# EasyEDA Pro project SRH_V2.0.eprj

# Schematic Schematic1
Create Date: 2023-11-20; Page Name: P1; Project Name: SRH_V2.0; Schematic Name: Schematic1; Update Date: 2025-01-16; Company: 嘉立创EDA; Page Size: A4; Version: V1.0
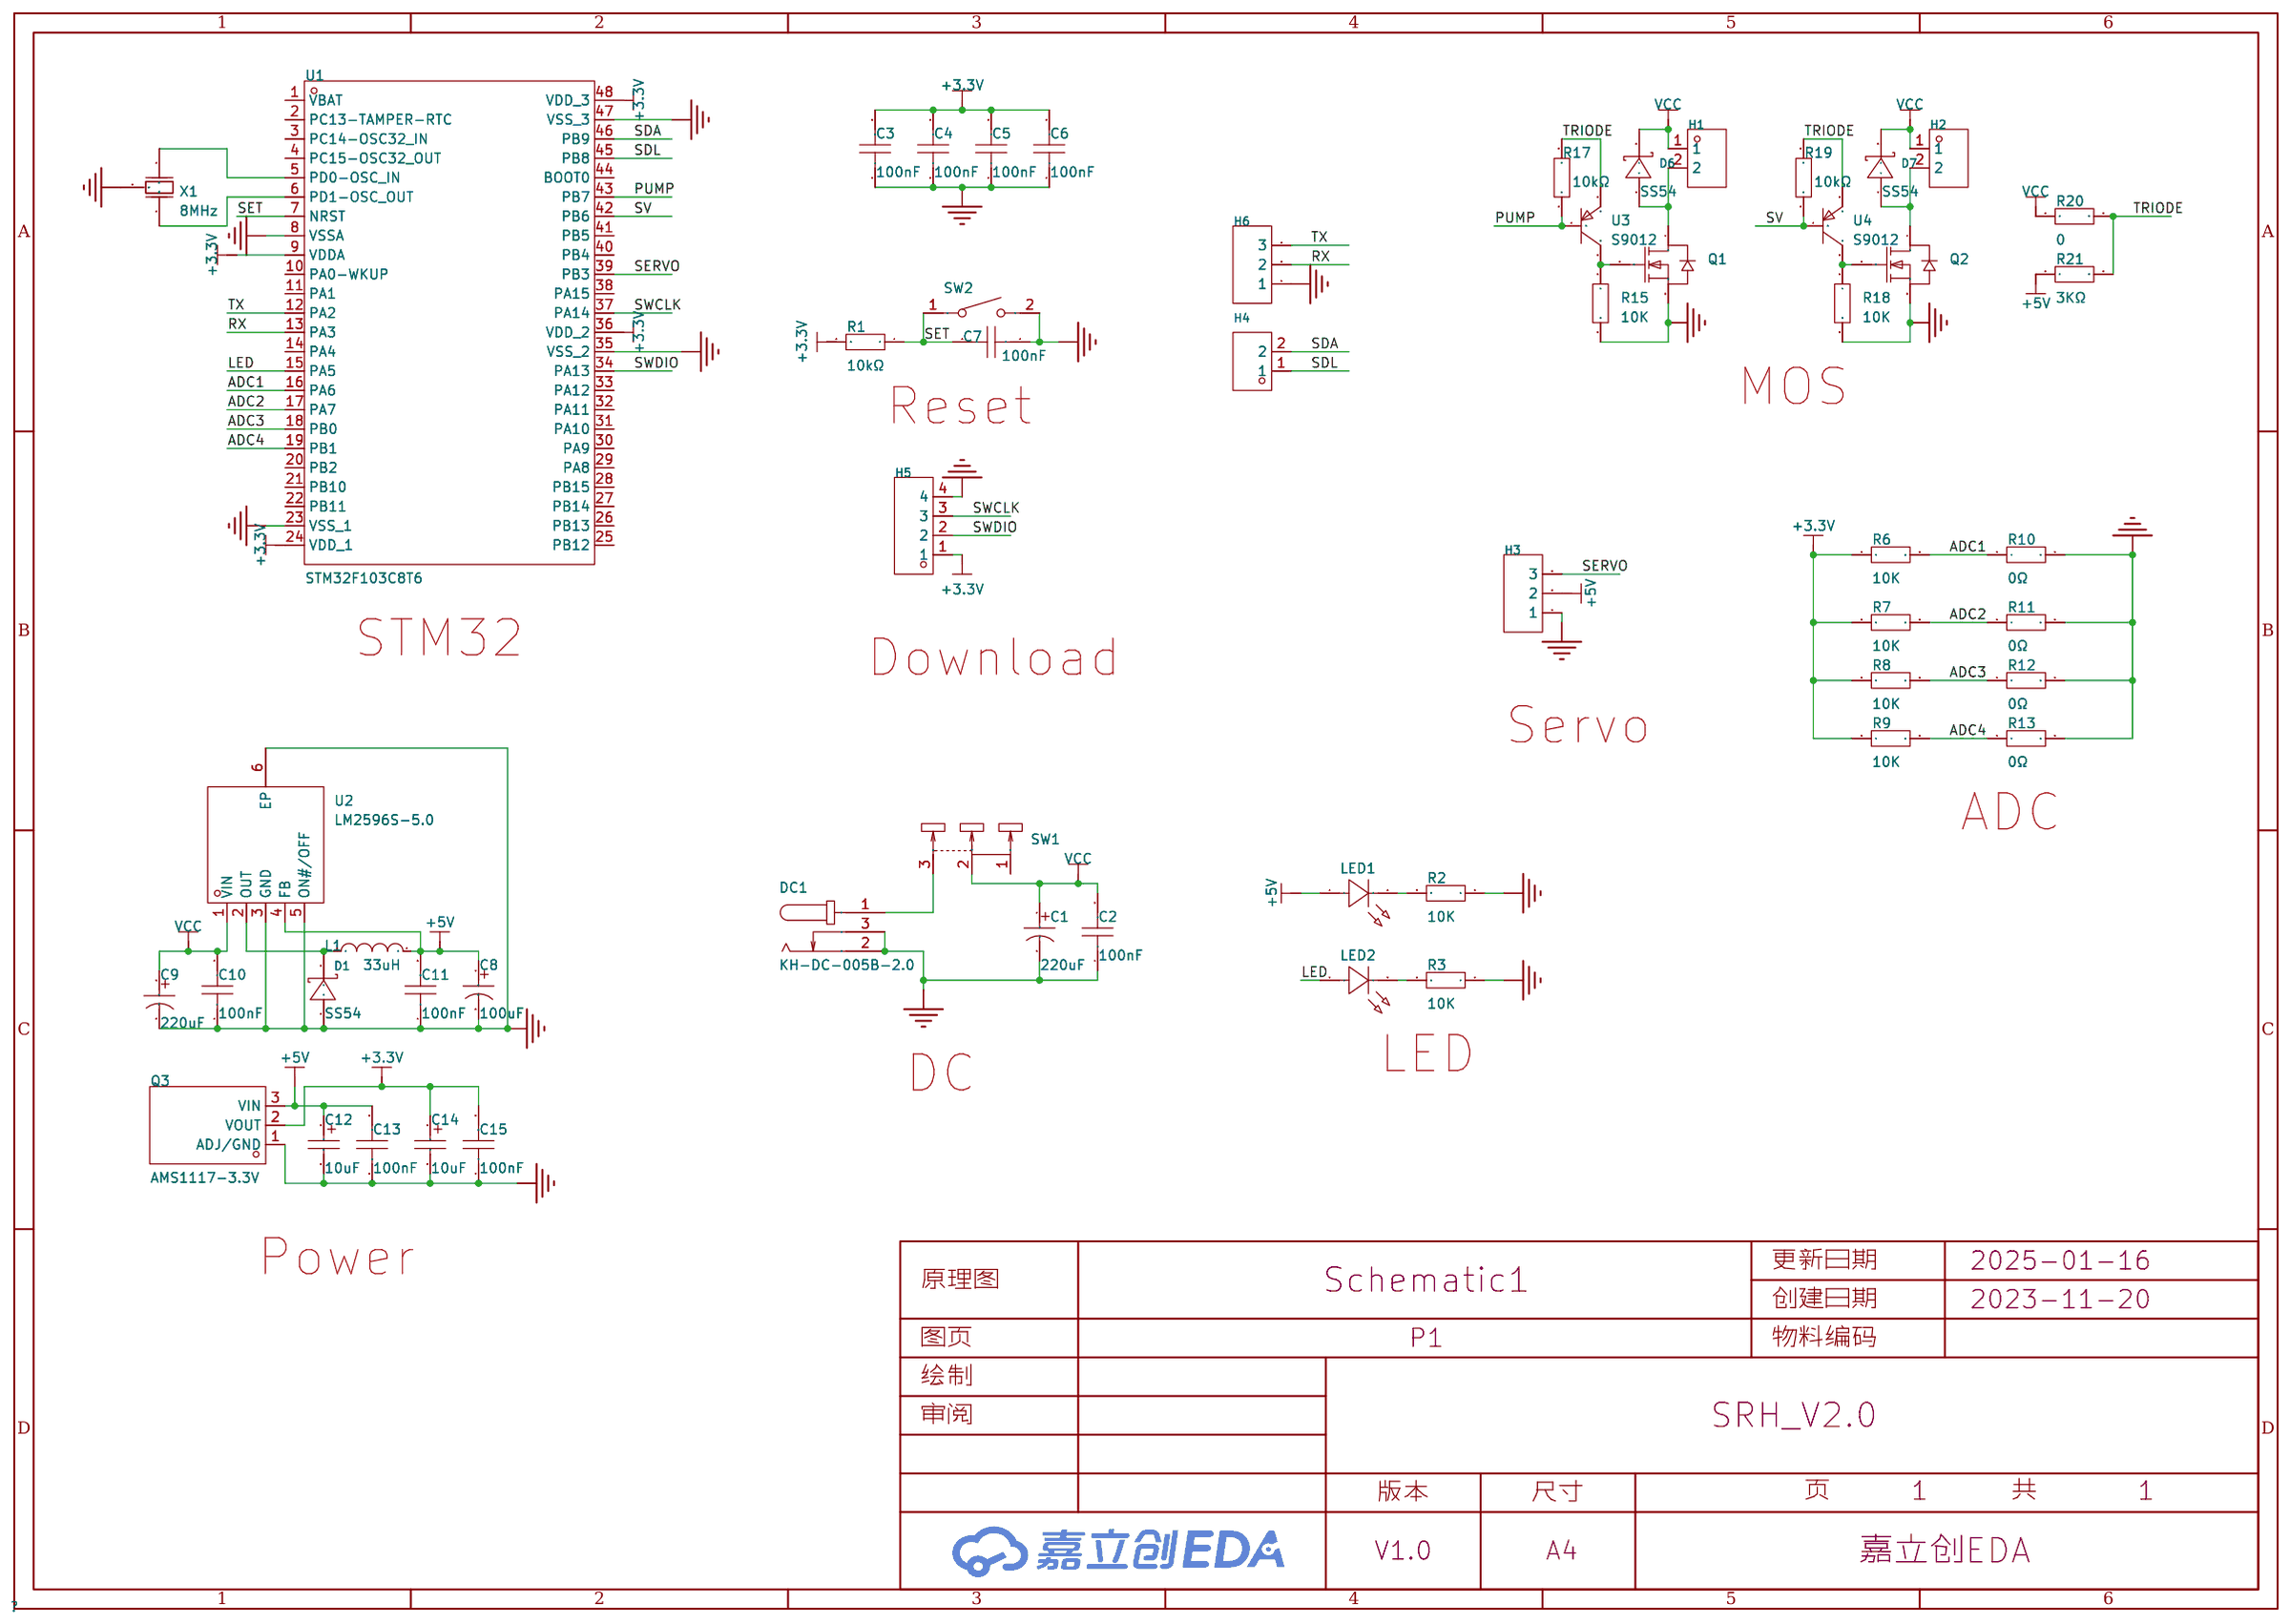
[diagram p0: schematic sheet]

## Parts
C1  220uF  [CAP-TH_BD6.3-P2.50-D1.0-FD]
C2  100nF  [C0603]
C3  100nF  [C0603]
C4  100nF  [C0603]
C5  100nF  [C0603]
C6  100nF  [C0603]
C7  100nF  [C0603]
C8  100uF  [CAP-TH_BD5.0-P2.00-D0.8-FD]
C9  220uF  [CAP-TH_BD6.3-P2.50-D1.0-FD]
C10  100nF  [C0603]
C11  100nF  [C0603]
C12  10uF  [CASE-A_3216]
C13  100nF  [C0603]
C14  10uF  [CASE-A_3216]
C15  100nF  [C0603]
D1  SS54  [SMA_L4.4-W2.8-LS5.4-R-RD]
D6  SS54  [SMA_L4.4-W2.8-LS5.4-R-RD]
D7  SS54  [SMA_L4.4-W2.8-LS5.4-R-RD]
DC1  KH-DC-005B-2.0  [DC-IN-TH_KH-DC-005B-2.0]
H1  PZ254V-11-02P  [HDR-TH_2P-P2.54-V-M]
H2  PZ254V-11-02P  [HDR-TH_2P-P2.54-V-M]
H3  2.54-1*3P针  [HDR-TH_3P-P2.54-V-M-1]
H4  PZ254V-11-02P  [HDR-TH_2P-P2.54-V-M]
H5  PZ254V-11-04P  [HDR-TH_4P-P2.54-V-M]
H6  2.54-1*3P针  [HDR-TH_3P-P2.54-V-M-1]
L1  33uH  [IND-SMD_L7.5-W7.5_CYH74]
LED1  19-213/GHC-ZN2Q1B8X/3T  [LED-SMD_L1.6-W0.8-RD-2]
LED2  19-213/GHC-ZN2Q1B8X/3T  [LED-SMD_L1.6-W0.8-RD-2]
Q1  IRLR7843TRPBF  [TO-252-2_L6.5-W6.1-P4.58-LS10.0-TR]
Q2  IRLR7843TRPBF  [TO-252-2_L6.5-W6.1-P4.58-LS10.0-TR]
Q3  AMS1117-3.3V  [SOT-89-3_L4.5-W2.5-P1.50-LS4.2-BR]
R1  10kΩ  [R0603]
R2  10K  [R0603]
R3  10K  [R0603]
R6  10K  [R0603]
R7  10K  [R0603]
R8  10K  [R0603]
R9  10K  [R0603]
R10  0Ω  [R1206]
R11  0Ω  [R1206]
R12  0Ω  [R1206]
R13  0Ω  [R1206]
R15  10K  [R0603]
R17  10kΩ  [R0603]
R18  10K  [R0603]
R19  10kΩ  [R0603]
R20  0  [R0603]
R21  3KΩ  [R0603]
SW1  SS-12D10L3  [SW-TH_SS-12D10L3]
SW2  TS-1185EC-C-D-B  [SW-SMD_4P-L3.7-W3.0-P1.50-LS4.7]
U1  STM32F103C8T6  [LQFP-48_L7.0-W7.0-P0.50-LS9.0-BL]
U2  LM2596S-5.0  [TO-263-5_L10.2-W8.9-P1.70-BR]
U3  S9012  [SOT-23-3_L2.9-W1.4-P1.90-LS2.6-BR]
U4  S9012  [SOT-23-3_L2.9-W1.4-P1.90-LS2.6-BR]
X1  8MHz  [OSC-SMD_3P-L3.2-W1.3-P1.2-L]

## Library data of the parts
C1 C9 = KS227M016E07RR0VH2FP0: 容值:220uF;精度:±20%;额定电压:16V;纹波电流:-;等效串联电阻:-;; LCSC Part Name: 220uF ±20% 16V; Supplier Part: C43340; Manufacturer: CX(承兴); Supplier Footprint: 插件,D6.3xL7mm; JLCPCB Part Class: 扩展库; Datasheet: https://atta.szlcsc.com/upload/public/pdf/source/20211027/7B10195EF01EB9374BE8935690E3D906.pdf; Supplier: LCSC; Tolerance: ±20%; Rated Voltage: 16V; φD: 6.3mm; L: 7mm; Lead Spacing: 2.5mm; Lifetime @ Temp: 1000hrs@105℃
C2 C13 C15 = CAP_0603: Supplier Footprint: 0603
C3-C7 C10 C11 = CC0603KRX7R9BB104: 容值:100nF;精度:±10%;额定电压:50V;材质(温度系数):X7R;; LCSC Part Name: 100nF ±10% 50V; Supplier Part: C14663; Manufacturer: YAGEO(国巨); Supplier Footprint: 0603; JLCPCB Part Class: Basic Part; Datasheet: https://atta.szlcsc.com/upload/public/pdf/source/20180910/C282072_33301C7F631E79921B82A8DAC6BCC5B3.pdf; Supplier: LCSC; Tolerance: ±10%; Voltage Rated: 50V; Temperature Coefficient: X7R
C8 = KS107M010D07RR0VH2FP0: 容值:100uF;精度:±20%;额定电压:10V;纹波电流:50mA@120Hz;等效串联电阻:-;; LCSC Part Name: 100uF ±20% 10V; Supplier Part: C43315; Manufacturer: CX(承兴); Supplier Footprint: 插件,D5xL7mm; JLCPCB Part Class: 扩展库; Datasheet: https://atta.szlcsc.com/upload/public/pdf/source/20211027/7B10195EF01EB9374BE8935690E3D906.pdf; Supplier: LCSC; Tolerance: ±20%; Rated Voltage: 10V; φD: 5mm; L: 7mm; Lead Spacing: 2mm; Ripple Current: 50mA@120Hz; Lifetime @ Temp: 1000hrs@105℃
C12 C14 = CA45A-A-16V-10uF-K: 容值:10uF;精度:±10%;额定电压:16V;等效串联电阻:7Ω@100kHz;; LCSC Part Name: 10uF ±10% 16V; Supplier Part: C129279; Manufacturer: CEC(振华新云); Supplier Footprint: CASE-A-3216; JLCPCB Part Class: 扩展库; Datasheet: https://atta.szlcsc.com/upload/public/pdf/source/20170914/C129279_1505359932790968137.pdf; Supplier: LCSC; Tolerance: ±10%; Rated Voltage: 16V; Equivalent Series Resistance(ESR): 7Ω@100kHz; Operating Temperature: -55℃~+125℃
D1 D6 D7 = SS54_C22452: 直流反向耐压（Vr）:40V;平均整流电流（Io）:5A;正向压降（Vf）:550mV @ 5A;; Supplier Part: C22452; Manufacturer: MDD; Supplier Footprint: SMA(DO-214AC); JLCPCB Part Class: 基础库; Supplier: LCSC
DC1 = KH-DC-005B-2.0: 连接器类型:DC电源插座;安装方式:弯插;触点内径:2mm;触点外径:6.3mm;额定电流:500mA;额定电压:30V;工作温度范围:-30℃~+70℃;; LCSC Part Name: DC电源插座 内径:2mm 外径:6.3mm; Supplier Part: C2847171; Manufacturer: kinghelm(金航标); Supplier Footprint: 插件; JLCPCB Part Class: Extended Part; Datasheet: https://atta.szlcsc.com/upload/public/pdf/source/20230214/A6338618A3D8E8EB8F2C466F0AFC1E00.pdf; Supplier: LCSC; Connector Type: DC电源插座; Mounting Style: 弯插; Inside Contact Diameter: 2mm; Outside Contact Diameter: 6.3mm; Current Rating (Max): 500mA; Voltage Rating (Max): 30V; Operating Temperature Range: -30℃~+70℃
H1 H2 H4 = PZ254V-11-02P: 排数:单排;总PIN位数:2P;间距:2.54mm;插针结构:1x2P;行距:-;安装类型:直插;圆针/方针:方针;额定电流:-;额定电压:-;配合针长度:6mm;塑高:2.5mm;端接针长度:3mm;触头材质:黄铜;触头镀层:-;工作温度范围:-40℃~+105℃;颜色:黑色;; LCSC Part Name: 2.54mm 1x2P 直插 方针; Supplier Part: C492401; Manufacturer: XFCN(兴飞); Supplier Footprint: 插件,P=2.54mm; JLCPCB Part Class: 扩展库; Datasheet: https://atta.szlcsc.com/upload/public/pdf/source/20200309/C492401_A812433581A9B211A7FFA413ADDFF0E5.pdf; Supplier: LCSC; Number of Rows: 单排; Number of Pins: 2P; Pitch: 2.54mm; Pin Structure: 1x2P; Mounting Type: 直插; Circluar Pins/Square Pins: 方针; Length of Mating Pin: 6mm; Insulation Height: 2.5mm; Length of End Connection Pin: 3mm; Contact Material: 黄铜; Operating Temperature Range: -40℃~+105℃; Color: 黑色
H3 H6 = 2.54-1*3P针: 排数:单排;总PIN位数:3;间距:2.54mm;插针结构:1x3P;行距:-;安装类型:直插;圆针/方针:方针;额定电流:3A;额定电压:-;配合针长度:-;塑高:-;端接针长度:-;触头材质:-;触头镀层:-;工作温度范围:-40℃~+105℃;颜色:黑色;; LCSC Part Name: 2.54mm 1x3P 直插 方针; Supplier Part: C49257; Manufacturer: BOOMELE(博穆精密); Supplier Footprint: 直插,P=2.54mm; JLCPCB Part Class: 扩展库; Supplier: LCSC; Number of Rows: 单排; Number of Pins: 3; Pitch: 2.54mm; Pin Structure: 1x3P; Mounting Type: 直插; Circluar Pins/Square Pins: 方针; Current Rating (Max): 3A; Operating Temperature Range: -40℃~+105℃; Color: 黑色
H5 = PZ254V-11-04P: 排数:单排;总PIN位数:4P;间距:2.54mm;插针结构:1x4P;行距:-;安装类型:直插;圆针/方针:方针;额定电流:3A;额定电压:250V;配合针长度:6mm;塑高:2.5mm;端接针长度:3mm;触头材质:-;工作温度范围:-40℃~+105℃;颜色:黑色;; LCSC Part Name: 2.54mm 1x4P 直插 方针; Supplier Part: C2691448; Manufacturer: XFCN(兴飞); Supplier Footprint: 插件,P=2.54mm; JLCPCB Part Class: 扩展库; Datasheet: https://atta.szlcsc.com/upload/public/pdf/source/20200309/C492403_F9F19131791D08044AD4F84F8E751A34.pdf; Supplier: LCSC; Number of Rows: 单排; Number of Pins: 4P; Pitch: 2.54mm; Pin Structure: 1x4P; Mounting Type: 直插; Circluar Pins/Square Pins: 方针; Current Rating (Max): 3A; Voltage Rating (Max): 250V; Length of Mating Pin: 6mm; Insulation Height: 2.5mm; Length of End Connection Pin: 3mm; Operating Temperature Range: -40℃~+105℃; Color: 黑色
L1 = CYH74-33UH: 类型:-;电感值:33uH;精度:±20%;额定电流:-;饱和电流(Isat):-;; LCSC Part Name: 33uH ±20%; Supplier Part: C2879696; Manufacturer: SHOU HAN(首韩); Supplier Footprint: SMD,7.5x7.5mm; JLCPCB Part Class: 扩展库; Datasheet: https://atta.szlcsc.com/upload/public/pdf/source/20210813/91E1001E07795DE2AA14A81FBCD1BD6C.pdf; Supplier: LCSC; Tolerance: ±20%
LED1 LED2 = 19-213/GHC-ZN2Q1B8X/3T: LCSC Part Name: LED; Supplier Part: C4749155; Manufacturer: EVERLIGHT(亿光); Supplier Footprint: SMD,0.8x1.6mm; JLCPCB Part Class: Extended Part; Datasheet: https://atta.szlcsc.com/upload/public/pdf/source/20220713/A02AED81541ACC0AB94B59F8C2FBBAFC.pdf; Supplier: LCSC
Q1 Q2 = IRLR7843TRPBF: 类型:N沟道;漏源电压(Vdss):30V;连续漏极电流(Id):161A;功率(Pd):140W;导通电阻(RDS(on)@Vgs,Id):3.3mΩ@10V,15A;阈值电压(Vgs(th)@Id):2.3V@250μA;; LCSC Part Name: N沟道 30V 161A; Supplier Part: C21988; Manufacturer: Infineon(英飞凌); Supplier Footprint: TO-252-2(DPAK); JLCPCB Part Class: Extended Part; Datasheet: https://atta.szlcsc.com/upload/public/pdf/source/20140314/1457707013919.pdf; Supplier: LCSC; Type: N沟道; Drain Source Voltage (Vdss): 30V; Continuous Drain Current (Id): 161A; Power Dissipation (Pd): 140W; Drain Source On Resistance (RDS(on)@Vgs,Id): 3.3mΩ@10V,15A; Gate Threshold Voltage (Vgs(th)@Id): 2.3V@250μA
Q3 = AMS1117-3.3V_C5120796: 输出类型:固定;输出极性:正;最大输入电压:18V;输出电压:3.3V;输出电流:1A;; LCSC Part Name: 输入18V 输出3.3V 1A; Supplier Part: C5120796; Manufacturer: MSKSEMI(美森科); Supplier Footprint: SOT-89; JLCPCB Part Class: 扩展库; Datasheet: https://atta.szlcsc.com/upload/public/pdf/source/20230802/A3918E880B22D5DA08FB6633703CD81C.pdf; Supplier: LCSC; Output Type: 固定; Output Polarity: 正; Number of Outputs: 1; Maximum Input Voltage: 18V; Output Voltage: 3.3V; Dropout Voltage: 1.4V@(1A); Quiescent Current (Ground Current): 12mA; Output Current: 1A; Operating Temperature: 0℃~+125℃
R1 R17 R19 = 0603WAF1002T5E: 电阻类型:厚膜电阻;阻值:10kΩ;精度:±1%;功率:100mW;; LCSC Part Name: 厚膜电阻 10kΩ ±1% 100mW; Supplier Part: C25804; Manufacturer: UNI-ROYAL(厚声); Supplier Footprint: 0603; JLCPCB Part Class: Basic Part; Datasheet: https://atta.szlcsc.com/upload/public/pdf/source/20200306/C422600_1E6D84923E4A46A82E41ADD87F860B5C.pdf; Supplier: LCSC; Type: 厚膜电阻; Tolerance: ±1%; Power(Watts): 100mW; Temperature Coefficient: ±100ppm/℃; Overload Voltage (Max): 75V; Operating Temperature Range: -55℃~+155℃
R2 R3 R6-R9 R15 R18 R20 R21 = Res_0603: Supplier Footprint: 0603
R10-R13 = 1206W4F0000T5E: 电阻类型:厚膜电阻;阻值:0Ω;精度:±1%;功率:250mW;温度系数:±800ppm/℃;最大工作电压:200V;工作温度范围:-55℃~+155℃;; LCSC Part Name: 0Ω ±1% 250mW; Supplier Part: C17888; Manufacturer: UNI-ROYAL(厚声); Supplier Footprint: 1206; JLCPCB Part Class: Basic Part; Supplier: LCSC; Type: 厚膜电阻; Tolerance: ±1%; Power(Watts): 250mW; Temperature Coefficient: ±800ppm/℃; Overload Voltage (Max): 200V; Operating Temperature Range: -55℃~+155℃
SW1 = SS-12D10L3: 额定电流(DC):3A;额定电压(DC):125V;额定电流(AC):3A;额定电压(AC):125V;电路结构:单刀双掷;安装方式:直插;机械寿命:1万次;开关颜色:黑色;; LCSC Part Name: 柄长3mm 直插双档 滑动开关 大电流; Supplier Part: C319013; Manufacturer: XKB Connectivity(中国星坤); Supplier Footprint: 插件; JLCPCB Part Class: Extended Part; Datasheet: https://atta.szlcsc.com/upload/public/pdf/source/20211009/D6412F37AABE6F9459A6EE7FA4DAEADB.pdf; Supplier: LCSC; Current Rating (DC): 3A; Voltage Rating (DC): 125V; Current Rating (AC): 3A; Voltage Rating (AC): 125V; Circuit: 单刀双掷; Mounting Style: 直插; Mechanical Life: 1万次; Actuator Color: 黑色; Actuator Style: 矩形柱状; Pin Style: PC引脚; Operating Temperature: -40℃~+85℃; Switch Length: 13mm; Switch Width: 6.8mm; Switch Height: 6.4mm
SW2 = TS-1185EC-C-D-B: 触点电流:50mA;额定电压(DC):12V;绝缘电阻:-;电路结构:单刀单掷;安装方式:立贴;带灯:无;作用力:260gf;机械寿命:10万次;带支架:否;; LCSC Part Name: 3.65*3*2mm 立贴 轻触开关; Supplier Part: C318893; Manufacturer: XKB Connectivity(中国星坤); Supplier Footprint: SMD; JLCPCB Part Class: 扩展库; Datasheet: https://atta.szlcsc.com/upload/public/pdf/source/20211011/37251E5FC3BB5C155D4391B78D14163F.pdf; Supplier: LCSC; Contact Current: 50mA; Voltage Rating (DC): 12V; Circuit: 单刀单掷; Mounting Style: 立贴; Actuator Style: 圆形按钮; Actuator/Cap Color: 黑色; With Lamp: 无; Operating Force: 260gf; Mechanical Life: 10万次; Operating Temperature: -30℃~+85℃; Switch Length: 3.65mm; Switch Width: 3mm; Switch Height: 2mm; Strike Gundam: 否
U1 = STM32F103C8T6: CPU内核:ARM Cortex-M3;CPU最大主频:72MHz;工作电压范围:2V~3.6V;程序存储容量:64KB;程序存储器类型:FLASH;RAM总容量:20KB;GPIO端口数量:37;; LCSC Part Name: STM32F103C8T6 MSL=3; Supplier Part: C8734; Manufacturer: ST(意法半导体); Supplier Footprint: LQFP-48(7x7); JLCPCB Part Class: 扩展库; Datasheet: https://atta.szlcsc.com/upload/public/pdf/source/20220812/8363ACEC51AD55ECEB84799464F7CB85.pdf; Supplier: LCSC; CPU Core: ARM Cortex-M3; CPU Maximum Speed: 72MHz; Operating Voltage Range: 2V~3.6V; Program Storage Size: 64KB; Program Memory Type: FLASH; RAM Size: 20KB; GPIO Ports Number: 37; ADC (Bit): 12bit; Universal Serial Bus: 有; Peripheral/Function: 看门狗；DMA；看门狗；片载温度传感器; Watchdog: 有; Infrared Data Association: 有; Low-Voltage Detect: 有; Direct Memory Access: 有; Internal Oscillator: 有; Operating Temperature Range: -40℃~+85℃
U2 = LM2596S-5.0_C347421: 功能类型:降压型;输出类型:固定;输入电压:40V;输出电压:5V;输出电流(最大值):3A;; LCSC Part Name: 降压型 输入40V 输出5V 3A; Supplier Part: C347421; Manufacturer: UMW(广东友台半导体); Supplier Footprint: TO-263-5; JLCPCB Part Class: 扩展库; Datasheet: https://atta.szlcsc.com/upload/public/pdf/source/20211011/C7416AEF3194BD283261B8F2553C4145.pdf; Supplier: LCSC; Function: 降压型; Synchronous Rectification: 否; Output Type: 固定; Number of Outputs: 1; Topology: 降压式; Input Voltage: 40V; Output Voltage: 5V; Output Current (Max): 3A; Switching Frequency: 150kHz; Operating Temperature: -40℃~+125℃@(TA)
U3 U4 = S9012_C5204710: 晶体管类型：PNP 集射极击穿电压(Vceo)：25V 集电极电流(Ic)：500mA 功率(Pd)：300mW; Supplier Part: C5204710; Manufacturer: TWGMC(台湾迪嘉); Supplier Footprint: SOT-23(TO-236); JLCPCB Part Class: 扩展库; Datasheet: https://atta.szlcsc.com/upload/public/pdf/source/20221019/7A4A581668A3BED1EE567F4F9DF28250.pdf; Supplier: LCSC
X1 = CSTNE8M00G55A000R0: 频率:8MHz;频率容差:±0.5%;内置负载电容:33pF;谐振阻抗:40Ω;; LCSC Part Name: 8MHz ±0.5% 内置负载电容:33pF; Supplier Part: C341523; Manufacturer: muRata(村田); Supplier Footprint: SMD3213-3P; JLCPCB Part Class: 扩展库; Datasheet: https://atta.szlcsc.com/upload/public/pdf/source/20200825/C341523_950053839A9C6B01BAE4CEAFDE23CC6C.pdf; Supplier: LCSC; Frequency Stability: ±0.2%; Frequency Tolerance: ±0.5%; Built-in Load Capacitance: 33pF; Resonant Impedance: 40Ω; Operating Temperature: -40℃~+125℃

## Nets
+3.3V: C3.2 C4.2 C5.2 C6.2 C14.1 C15.2 H5.1 Q3.2(VOUT) R1.2 R6.1 R7.1 R8.1 R9.1 U1.9(VDDA) U1.24(VDD_1) U1.36(VDD_2) U1.48(VDD_3)
+5V: C8.1 C11.2 C12.1 C13.2 H3.2 L1.2 LED1.1(A) Q3.3(VIN) R21.1 U2.4(FB)
GND: C1.2 C2.1 C3.1 C4.1 C5.1 C6.1 C7.1 C8.2 C9.2 C10.1 C11.1 C12.2 C13.1 C14.2 C15.1 D1.1(A) DC1.2 DC1.3 H3.1 H5.4 H6.1 Q1.3(S) Q2.3(S) Q3.1(ADJ/GND) R2.1 R3.1 R10.2 R11.2 R12.2 R13.2 R15.2 R18.2 SW2.2 U1.8(VSSA) U1.23(VSS_1) U1.35(VSS_2) U1.47(VSS_3) U2.3(GND) U2.5(ON#/OFF) U2.6(EP) X1.2(GND)
VCC: C1.1 C2.2 C9.1 C10.2 D6.2(K) D7.2(K) H1.1 H2.1 R20.1 SW1.2 U2.1(VIN)
ADC1: R6.2 R10.1 U1.16(PA6)
ADC2: R7.2 R11.1 U1.17(PA7)
ADC3: R8.2 R12.1 U1.18(PB0)
ADC4: R9.2 R13.1 U1.19(PB1)
LED: LED2.1(A) U1.15(PA5)
PUMP: R17.1 U1.43(PB7) U3.1(B)
RX: H6.2 U1.13(PA3)
SDA: H4.2 U1.46(PB9)
SDL: H4.1 U1.45(PB8)
SERVO: H3.3 U1.39(PB3)
SET: C7.2 R1.1 SW2.1 U1.7(NRST)
SV: R19.1 U1.42(PB6) U4.1(B)
SWCLK: H5.3 U1.37(PA14)
SWDIO: H5.2 U1.34(PA13)
TRIODE: R17.2 R19.2 R20.2 R21.2 U3.2(E) U4.2(E)
TX: H6.3 U1.12(PA2)
$1N1024: U1.5(PD0-OSC_IN) X1.3(OSC2)
$1N1025: U1.6(PD1-OSC_OUT) X1.1(OSC1)
$1N1270: LED1.2(K) R2.2
$1N1274: LED2.2(K) R3.2
$1N1385: DC1.1 SW1.3
$1N2282: D1.2(K) L1.1 U2.2(OUT)
$1N13168: Q1.1(G) R15.1 U3.3(C)
$1N15259: D6.1(A) H1.2 Q1.4(D)
$1N15509: Q2.1(G) R18.1 U4.3(C)
$1N15513: D7.1(A) H2.2 Q2.4(D)

Not connected (* = marked no-connect by the designer): SW1 1; U1 1(VBAT) 2(PC13-TAMPER-RTC) 3(PC14-OSC32_IN) 4(PC15-OSC32_OUT) 10(PA0-WKUP) 11(PA1) 14(PA4) 20(PB2) 21(PB10) 22(PB11) 25(PB12) 26(PB13) 27(PB14) 28(PB15) 29(PA8) 30(PA9) 31(PA10) 32(PA11) 33(PA12) 38(PA15) 40(PB4) 41(PB5) 44(BOOT0)

## Notes on the sheet
- MOS
- Reset
- STM32
- Download
- Servo
- ADC
- DC
- LED
- Power

# Board PCB1
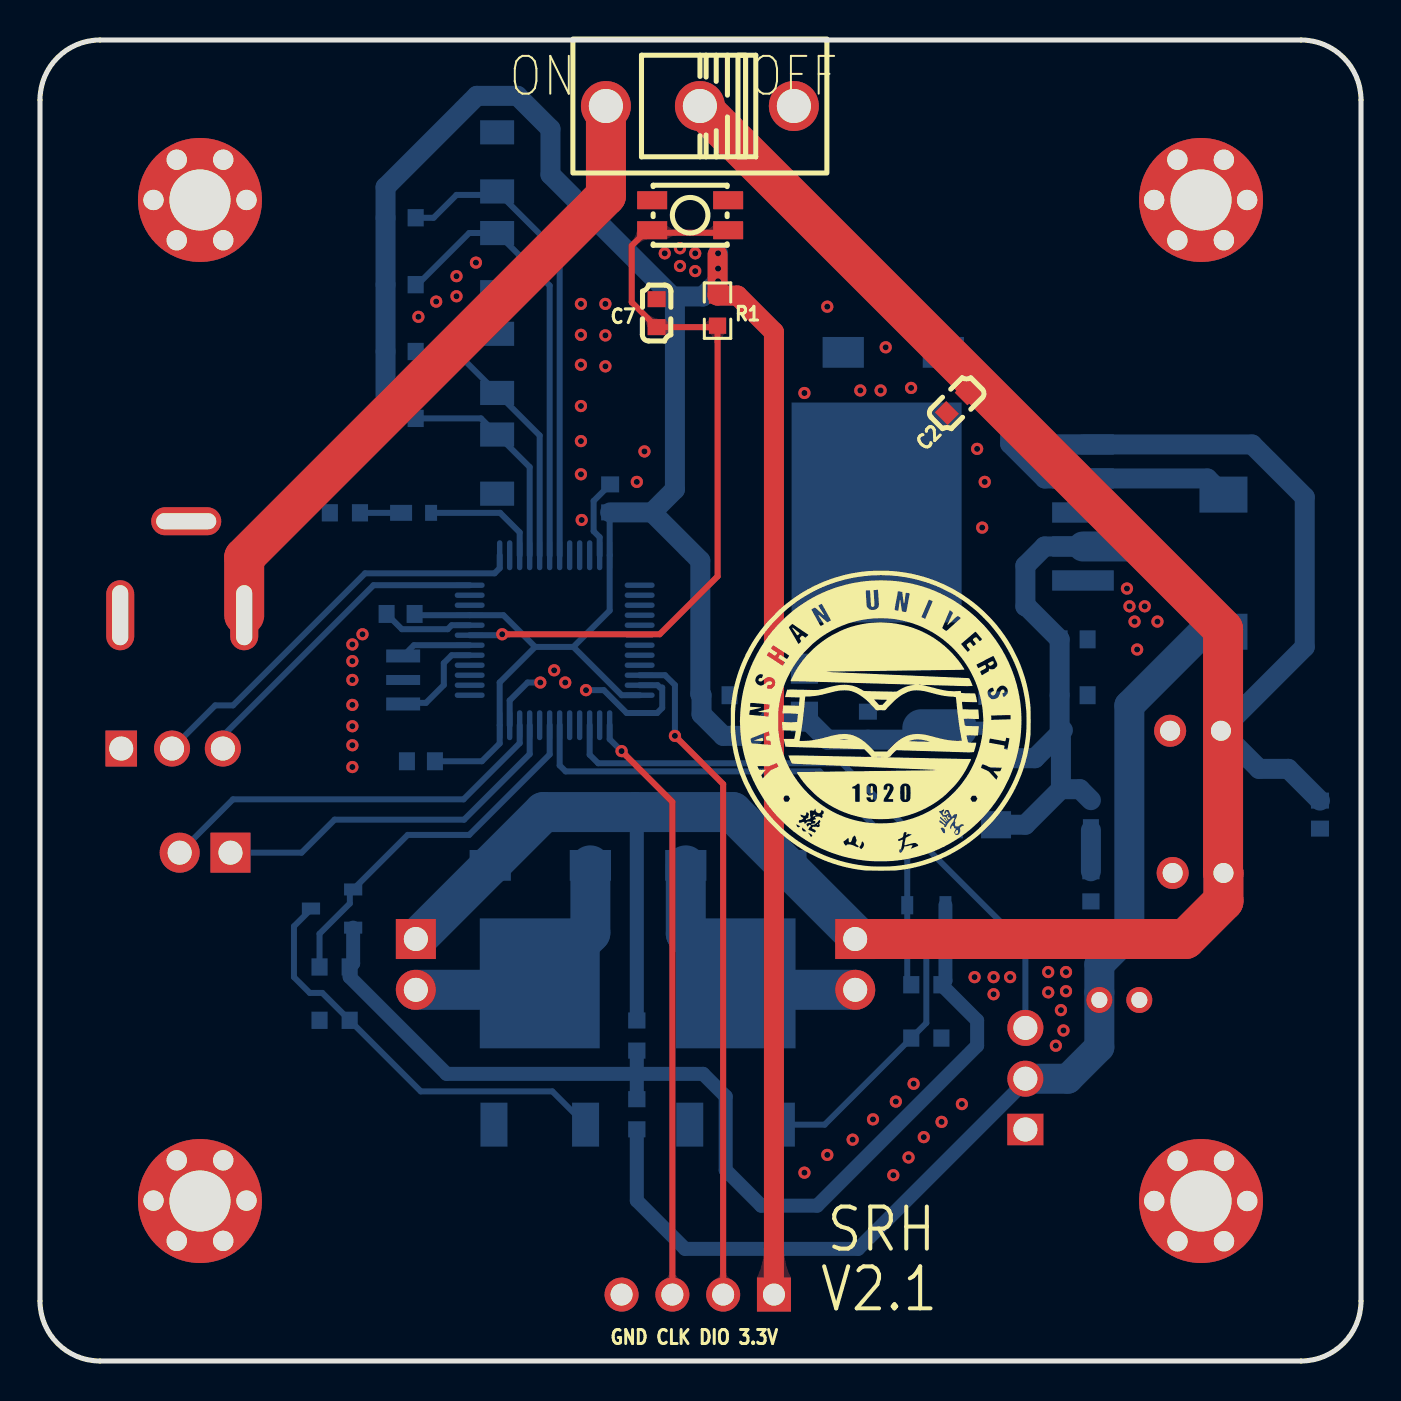
[diagram p1: board, top side]
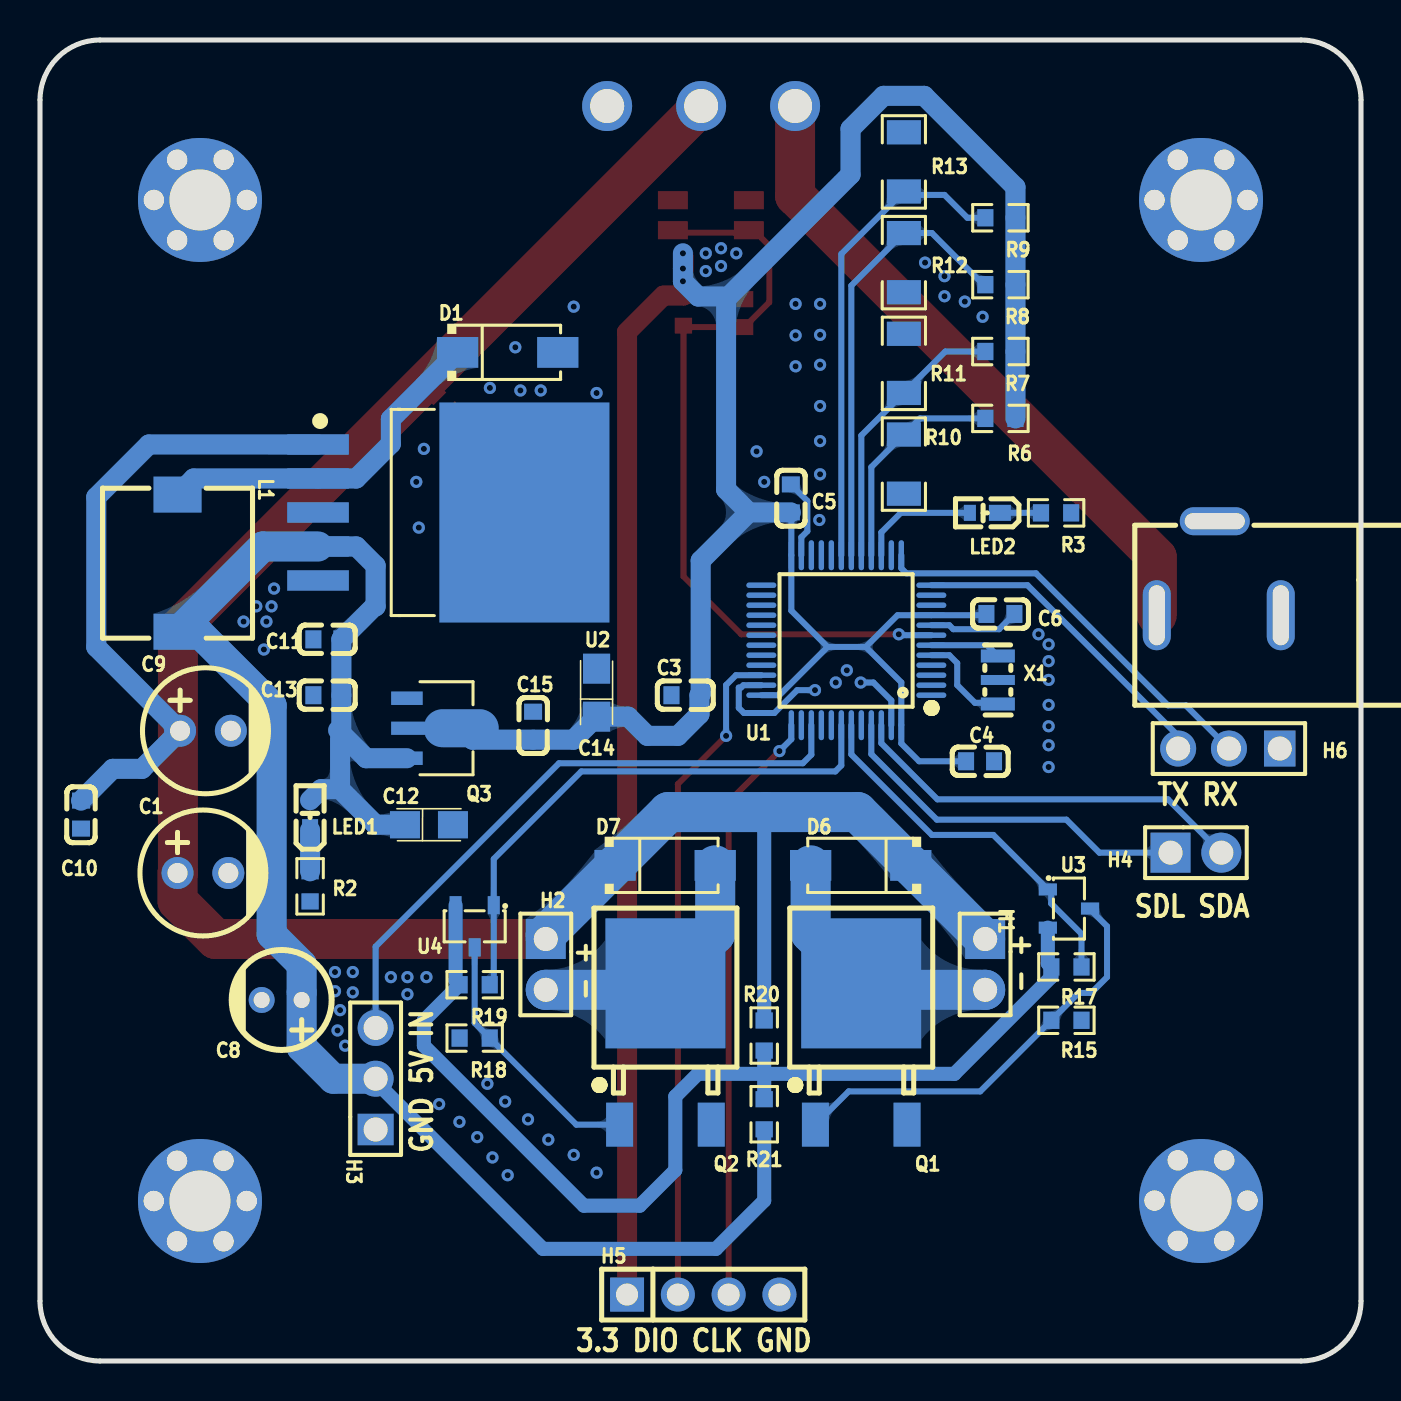
[diagram p2: board, bottom side, seen from below]

Outline 66.06 x 66.06 mm; copper layers: Top Layer, Bottom Layer. Coordinates in mm from the lower left corner of the outline.
Outline path: 0,63.06 arc(0.88,65.18) 3,66.06 63.06,66.06 arc(65.18,65.18) 66.06,63.06 66.06,3 arc(65.18,0.88) 63.06,0 3,0 arc(0.88,0.88) 0,3 0,63.06
Stack: Top Layer 0.035mm / Dielectric1 1.51mm FR4 er 4.5 / Bottom Layer 0.035mm

## Design rules (mm)
template: 自定义配置
spacing copperThickness1oz (default): track to track 0.102, other pairs 0.152 to 0.3
spacing copperThickness2oz: track to track 0.203, other pairs 0.152 to 0.3
track width copperThickness1oz (default): min 0.127, default 0.254, max 2.54
track width copperThickness2oz: min 0.203, default 0.254, max 2.54
differential pair differentialPair (default): width min 0.127, default 0.254, max 2.54; gap min 0.152, default 0.152
via viaSize (default): diameter min 0.5, default 0.61, max 10; hole min 0.3, default 0.305, max 6.3

## Placement (name value [footprint] x y rotation side)
C1  220uF  [CAP-TH_BD6.3-P2.50-D1.0-FD]  57.91 24.4 180 bottom
C2  100nF  [C0603]  45.85 47.9 45 top
C3  100nF  [C0603]  33.78 33.29 180 bottom
C4  100nF  [C0603]  19.05 29.99 0 bottom
C5  100nF  [C0603]  28.51 43.14 270 bottom
C6  100nF  [C0603]  18.03 37.36 0 bottom
C7  100nF  [C0603]  30.83 52.4 270 top
C8  100uF  [CAP-TH_BD5.0-P2.00-D0.8-FD]  53.97 18.05 0 bottom
C9  220uF  [CAP-TH_BD6.3-P2.50-D1.0-FD]  57.78 31.52 180 bottom
C10  100nF  [C0603]  64.01 27.33 90 bottom
C11  100nF  [C0603]  51.69 36.09 180 bottom
C12  10uF  [CASE-A_3216]  46.61 26.82 180 bottom
C13  100nF  [C0603]  51.69 33.29 180 bottom
C14  10uF  [CASE-A_3216]  38.23 33.42 90 bottom
C15  100nF  [C0603]  41.4 31.77 270 bottom
D1  SS54  [SMA_L4.4-W2.8-LS5.4-R-RD]  42.67 50.44 180 bottom
D6  SS54  [SMA_L4.4-W2.8-LS5.4-R-RD]  25.02 24.78 0 bottom
D7  SS54  [SMA_L4.4-W2.8-LS5.4-R-RD]  34.8 24.78 180 bottom
DC1  KH-DC-005B-2.0  [DC-IN-TH_KH-DC-005B-2.0]  7.11 39.64 0 bottom
H1  PZ254V-11-02P  [HDR-TH_2P-P2.54-V-M]  18.8 19.83 270 bottom
H2  PZ254V-11-02P  [HDR-TH_2P-P2.54-V-M]  40.77 19.83 270 bottom
H3  2.54-1*3P针  [HDR-TH_3P-P2.54-V-M-1]  49.28 14.12 90 bottom
H4  PZ254V-11-02P  [HDR-TH_2P-P2.54-V-M]  8.25 25.42 180 bottom
H5  PZ254V-11-04P  [HDR-TH_4P-P2.54-V-M]  32.89 3.32 180 bottom
H6  2.54-1*3P针  [HDR-TH_3P-P2.54-V-M-1]  6.6 30.63 0 bottom
L1  33uH  [IND-SMD_L7.5-W7.5_CYH74]  59.18 39.9 270 bottom
LED1  19-213/GHC-ZN2Q1B8X/3T  [LED-SMD_L1.6-W0.8-RD-2]  52.55 27.3 90 bottom
LED2  19-213/GHC-ZN2Q1B8X/3T  [LED-SMD_L1.6-W0.8-RD-2]  18.81 42.41 0 bottom
NOREF  -  [Pad_e92]  58.06 8 0 top
NOREF#2  -  [Pad_e90]  9.16 10.03 0 top
NOREF#3  -  [Pad_e87]  5.68 8.02 0 top
NOREF#4  -  [Pad_e104]  59.2 60.07 0 top
NOREF#5  -  [Pad_e102]  56.88 60.07 0 top
NOREF#6  -  [Pad_e91]  6.84 6.01 0 top
NOREF#7  -  [Pad_e85]  8 8 0 top
NOREF#8  -  [Pad_e98]  56.88 5.99 0 top
NOREF#9  -  [Pad_e100]  60.36 58.06 0 top
NOREF#10  -  [Pad_e84]  6.84 56.05 0 top
NOREF#11  -  [Pad_e96]  59.21 5.99 0 top
NOREF#12  -  [Pad_e93]  60.37 8 0 top
NOREF#13  -  [Pad_e105]  56.88 56.05 0 top
NOREF#14  -  [Pad_e103]  59.2 56.05 0 top
NOREF#15  -  [Pad_e89]  9.16 6.01 0 top
NOREF#16  -  [Pad_e88]  6.84 10.03 0 top
NOREF#17  -  [Pad_e101]  55.71 58.06 0 top
NOREF#18  -  [Pad_e97]  59.21 10.01 0 top
NOREF#19  -  [Pad_e94]  55.72 8 0 top
NOREF#20  -  [Pad_e86]  10.33 8.02 0 top
NOREF#21  -  [Pad_e95]  56.88 10.01 0 top
NOREF#22  -  [Pad_e82]  9.16 56.05 0 top
NOREF#23  -  [Pad_e81]  6.84 60.07 0 top
NOREF#24  -  [Pad_e79]  10.33 58.06 0 top
NOREF#25  -  [Pad_e99]  58.06 58.06 0 top
NOREF#26  -  [Pad_e83]  9.16 60.07 0 top
NOREF#27  -  [Pad_e78]  8 58.06 0 top
NOREF#28  -  [Pad_e80]  5.68 58.06 0 top
Q1  IRLR7843TRPBF  [TO-252-2_L6.5-W6.1-P4.58-LS10.0-TR]  24.99 15.35 0 bottom
Q2  IRLR7843TRPBF  [TO-252-2_L6.5-W6.1-P4.58-LS10.0-TR]  34.78 15.35 0 bottom
Q3  AMS1117-3.3V  [SOT-89-3_L4.5-W2.5-P1.50-LS4.2-BR]  46.35 31.64 0 bottom
R1  10kΩ  [R0603]  33.88 52.53 90 top
R2  10K  [R0603]  52.55 23.74 90 bottom
R3  10K  [R0603]  15.25 42.41 0 bottom
R6  10K  [R0603]  18.03 47.14 0 bottom
R7  10K  [R0603]  18.03 50.48 0 bottom
R8  10K  [R0603]  18.03 53.83 0 bottom
R9  10K  [R0603]  18.03 57.17 0 bottom
R10  0Ω  [R1206]  22.86 44.85 270 bottom
R11  0Ω  [R1206]  22.86 49.89 90 bottom
R12  0Ω  [R1206]  22.86 54.93 270 bottom
R13  0Ω  [R1206]  22.86 59.96 90 bottom
R15  10K  [R0603]  14.73 17.04 180 bottom
R17  10kΩ  [R0603]  14.73 19.7 0 bottom
R18  10K  [R0603]  44.32 16.15 0 bottom
R19  10kΩ  [R0603]  44.32 18.82 0 bottom
R20  0  [R0603]  29.84 16.28 270 bottom
R21  3KΩ  [R0603]  29.84 12.34 90 bottom
SW1  SS-12D10L3  [SW-TH_SS-12D10L3]  33 62.76 180 top
SW2  TS-1185EC-C-D-B  [SW-SMD_4P-L3.7-W3.0-P1.50-LS4.7]  32.51 57.3 180 top
U1  STM32F103C8T6  [LQFP-48_L7.0-W7.0-P0.50-LS9.0-BL]  25.74 36.04 90 bottom
U2  LM2596S-5.0  [TO-263-5_L10.2-W8.9-P1.70-BR]  47 42.43 0 bottom
U3  S9012  [SOT-23-3_L2.9-W1.4-P1.90-LS2.6-BR]  14.6 22.63 0 bottom
U4  S9012  [SOT-23-3_L2.9-W1.4-P1.90-LS2.6-BR]  44.32 21.74 90 bottom
X1  8MHz  [OSC-SMD_3P-L3.2-W1.3-P1.2-L]  18.16 34.06 270 bottom

## Footprints (pads in the part's own frame, mm; a bottom-side part is the same pattern mirrored in y, then rotated)
C0603
  rect 0.8x0.9 smd: 1(-0.7,0) 2(0.7,0)
CAP-TH_BD5.0-P2.00-D0.8-FD
  round 1.3 hole 0.8: 1(-1,0) 2(1,0)
CAP-TH_BD6.3-P2.50-D1.0-FD
  round 1.6 hole 1: 1(-1.27,0) 2(1.27,0)
CASE-A_3216
  rect 1.5x1.359 smd: 1(-1.2,0) 2(1.2,0)
DC-IN-TH_KH-DC-005B-2.0
  oval 1.4x3.5 hole 0.8x3: 1(3.1,2.35) 2(-3.1,2.35)
  oval 3.5x1.4 hole 3x0.8: 3(0.2,-2.35)
HDR-TH_2P-P2.54-V-M
  rect 2x2 hole 1.2: 1(-1.27,0)
  round 2 hole 1.2: 2(1.27,0)
HDR-TH_3P-P2.54-V-M-1
  rect 1.575x1.8 hole 1.2: 1(-2.54,0)
  round 1.8 hole 1.2: 2(0,0) 3(2.54,0)
HDR-TH_4P-P2.54-V-M
  rect 1.7x1.7 hole 1.1: 1(-3.81,0)
  round 1.7 hole 1.1: 2(-1.27,0) 3(1.27,0) 4(3.81,0)
IND-SMD_L7.5-W7.5_CYH74
  rect 1.8x2.4 smd: 1(-3.429,0) 2(3.429,0)
LED-SMD_L1.6-W0.8-RD-2
  rect 0.6x0.8 smd: 1(0.75,0)
  rect 1.1x0.8 smd: 2(-0.75,0)
LQFP-48_L7.0-W7.0-P0.50-LS9.0-BL
  oval 0.27x1.5 smd: 1(-2.75,-4.25) 2(-2.25,-4.25) 3(-1.75,-4.25) 4(-1.25,-4.25) 5(-0.75,-4.25) 6(-0.25,-4.25) 7(0.25,-4.25) 8(0.75,-4.25) 9(1.25,-4.25) 10(1.75,-4.25) 11(2.25,-4.25) 12(2.75,-4.25) 25(2.75,4.25) 26(2.25,4.25) 27(1.75,4.25) 28(1.25,4.25) 29(0.75,4.25) 30(0.25,4.25) 31(-0.25,4.25) 32(-0.75,4.25) 33(-1.25,4.25) 34(-1.75,4.25) 35(-2.25,4.25) 36(-2.75,4.25)
  oval 1.5x0.27 smd: 13(4.25,-2.75) 14(4.25,-2.25) 15(4.25,-1.75) 16(4.25,-1.25) 17(4.25,-0.75) 18(4.25,-0.25) 19(4.25,0.25) 20(4.25,0.75) 21(4.25,1.25) 22(4.25,1.75) 23(4.25,2.25) 24(4.25,2.75) 37(-4.25,2.75) 38(-4.25,2.25) 39(-4.25,1.75) 40(-4.25,1.25) 41(-4.25,0.75) 42(-4.25,0.25) 43(-4.25,-0.25) 44(-4.25,-0.75) 45(-4.25,-1.25) 46(-4.25,-1.75) 47(-4.25,-2.25) 48(-4.25,-2.75)
OSC-SMD_3P-L3.2-W1.3-P1.2-L
  rect 0.65x1.7 smd: 1(-1.2,0) 3(1.2,0)
  rect 0.5x1.7 smd: 2(0,0)
Pad_e78
  round 6.2 hole 3.05: 1(0,0)
Pad_e79
  round 1.016 hole 1.021x1.016: 1(0,0)
Pad_e80
  round 1.016 hole 1.021x1.016: 1(0,0)
Pad_e81
  round 1.016 hole 1.021x1.016: 1(0,0)
Pad_e82
  round 1.016 hole 1.021x1.016: 1(0,0)
Pad_e83
  round 1.016 hole 1.021x1.016: 1(0,0)
Pad_e84
  round 1.016 hole 1.021x1.016: 1(0,0)
Pad_e85
  round 6.2 hole 3.05: 1(0,0)
Pad_e86
  round 1.016 hole 1.021x1.016: 1(0,0)
Pad_e87
  round 1.016 hole 1.021x1.016: 1(0,0)
Pad_e88
  round 1.016 hole 1.021x1.016: 1(0,0)
Pad_e89
  round 1.016 hole 1.021x1.016: 1(0,0)
Pad_e90
  round 1.016 hole 1.021x1.016: 1(0,0)
Pad_e91
  round 1.016 hole 1.021x1.016: 1(0,0)
Pad_e92
  round 6.2 hole 3.05: 1(0,0)
Pad_e93
  round 1.016 hole 1.021x1.016: 1(0,0)
Pad_e94
  round 1.016 hole 1.021x1.016: 1(0,0)
Pad_e95
  round 1.016 hole 1.021x1.016: 1(0,0)
Pad_e96
  round 1.016 hole 1.021x1.016: 1(0,0)
Pad_e97
  round 1.016 hole 1.021x1.016: 1(0,0)
Pad_e98
  round 1.016 hole 1.021x1.016: 1(0,0)
Pad_e99
  round 6.2 hole 3.05: 1(0,0)
Pad_e100
  round 1.016 hole 1.021x1.016: 1(0,0)
Pad_e101
  round 1.016 hole 1.021x1.016: 1(0,0)
Pad_e102
  round 1.016 hole 1.021x1.016: 1(0,0)
Pad_e103
  round 1.016 hole 1.021x1.016: 1(0,0)
Pad_e104
  round 1.016 hole 1.021x1.016: 1(0,0)
Pad_e105
  round 1.016 hole 1.021x1.016: 1(0,0)
R0603
  rect 0.806x0.864 smd: 1(-0.753,0) 2(0.753,0)
R1206
  rect 1.208x1.701 smd: 1(-1.479,0) 2(1.479,0)
SMA_L4.4-W2.8-LS5.4-R-RD
  rect 2.062x1.539 smd: 1(2.503,0) 2(-2.503,0)
SOT-23-3_L2.9-W1.4-P1.90-LS2.6-BR
  rect 0.91x0.6 smd: 1(1.055,-0.955) 2(1.055,0.955) 3(-1.055,0)
SOT-89-3_L4.5-W2.5-P1.50-LS4.2-BR
  rect 1.575x0.672 smd: 1(1.356,-1.5) 3(1.356,1.5)
  custom 5.377x1.9 smd: 2(-1.356,0)
SW-SMD_4P-L3.7-W3.0-P1.50-LS4.7
  rect 1.5x0.9 smd: 1(-1.9,0.75) 1(1.9,0.75) 2(-1.9,-0.75) 2(1.9,-0.75)
SW-TH_SS-12D10L3
  round 2.5 hole 1.7: 1(-4.7,0) 2(0,0) 3(4.7,0)
TO-252-2_L6.5-W6.1-P4.58-LS10.0-TR
  rect 1.351x2.2 smd: 1(2.291,3.533) 3(-2.291,3.533)
  rect 6x6.5 smd: 4(0,-3.533)
TO-263-5_L10.2-W8.9-P1.70-BR
  rect 3.083x1.02 smd: 1(5.16,-3.4) 2(5.16,-1.7) 3(5.16,0) 4(5.16,1.7) 5(5.16,3.4)
  rect 8.5x11 smd: 6(-5.16,0)

## Nets
As in the schematic.

Pads without a net: NOREF 1; NOREF#2 1; NOREF#3 1; NOREF#4 1; NOREF#5 1; NOREF#6 1; NOREF#7 1; NOREF#8 1; NOREF#9 1; NOREF#10 1; NOREF#11 1; NOREF#12 1; NOREF#13 1; NOREF#14 1; NOREF#15 1; NOREF#16 1; NOREF#17 1; NOREF#18 1; NOREF#19 1; NOREF#20 1; NOREF#21 1; NOREF#22 1; NOREF#23 1; NOREF#24 1; NOREF#25 1; NOREF#26 1; NOREF#27 1; NOREF#28 1; SW1 1; U1 1 2 3 4 10 11 14 20 21 22 25 26 27 28 29 30 31 32 33 38 40 41 44

## Via types
v1: diameter 0.61, hole 0.305, Top Layer to Bottom Layer, 77 vias

## Routing (per net, layer and track width the routed paths; a pad name or vN(x,y) marks a point on that pad's centre or on a via; arc(x,y) is an arc through that point)
+3.3V: length 158.4
  Top Layer w1: 33.88,55.32 R1.2 34.88,53.28 36.7,51.45 H5.1
  Bottom Layer w0.3: 26.67,35.71 28.49,37.52 U1.24 28.49,42.41 C5.2 ; 26.67,35.71 24.76,35.71 ; 26.67,35.71 29.09,33.29 U1.36 ; C6.2 18.8,37.29 U1.9 23.18,37.29 24.76,35.71 ; 24.76,35.71 22.99,33.93 U1.48 22.99,30.88 22.1,29.99 C4.2
  Bottom Layer w1: C5.2 30.61,42.44 ; 31.88,53.23 33.15,53.23 v1(33.91,54) v1(33.91,54.63) v1(33.91,55.39) ; 30.61,42.44 33.02,40.03 33.02,33.36 C3.2 33.08,32.34 34.16,31.26 35.69,31.26 36.65,32.22 C14.1 39.38,31.07 C15.2 44.43,31.07 Q3.2 ; R6.1 R7.1 R8.1 R9.1 17.28,58.7 21.84,63.27 23.88,63.27 25.53,61.62 25.53,59.33 31.75,53.11 31.75,43.58 30.61,42.44
+5V: length 89.4
  Bottom Layer w0.7: H3.2 49.28,13.98 40.91,5.61 32.26,5.61 29.84,8.02 R21.1
  Bottom Layer w1: C12.1 49.28,26.82 51.05,28.59 ; 51.05,28.59 52,28.59 LED1.1 ; 51.05,28.59 51.05,31.14 ; 50.99,31.38 49.75,30.14 47.71,30.14 ; 50.99,31.38 51.15,31.54 ; 50.99,31.38 C13.2 C11.2 49.34,37.74 49.28,37.74 49.28,39.77 50.24,40.73 U2.4
  Bottom Layer w1.5: H3.2 51.4,14.12 52.97,15.69 52.97,19.84 54.47,21.34 54.47,32.78 58.17,36.47 L1.2 54.92,40.73 U2.4
GND: length 18.3
  Bottom Layer w0.3: U1.8 20.59,36.79 20.39,36.6 18.1,36.6 C6.1 ; U1.35 30.89,33.79 31.01,33.67 31.12,33.67 31.12,32.66 30.86,32.41 29.34,32.41 28.19,33.55 v1(27.31,33.55) ; U1.47 23.49,33.03 24.38,33.93 v1(25.02,33.93) ; U1.23 27.99,41.19 27.69,41.5 27.69,43.01 C5.1
  vias: v1(15.62,35.83) v1(15.62,35) v1(15.62,34.06) v1(15.62,32.81) v1(15.62,31.74) v1(15.62,30.79) v1(15.62,29.7) v1(16.13,36.34) v1(18.92,52.22) v1(19.81,52.98) v1(20.83,54.25) v1(20.83,53.25) v1(21.8,54.93) v1(25.71,34.54) v1(26.27,33.93) v1(27.05,52.86) v1(27.05,51.31) v1(27.05,49.82) v1(27.05,47.76) v1(27.05,46) v1(27.05,44.34) v1(27.09,42.06) v1(28.27,52.86) v1(28.27,51.29) v1(28.27,49.74) v1(29.84,43.96) v1(30.23,45.49) v1(31.24,55.39) v1(32,55.65) v1(32,54.76) v1(32.77,55.39) v1(32.77,54.5) v1(38.23,48.41) v1(38.23,9.42) v1(39.37,52.73) v1(39.37,10.31) v1(40.64,11.07) v1(41.02,48.53) v1(41.66,12.09) v1(42.04,48.53) v1(42.29,50.69) v1(42.67,9.29) v1(42.8,12.97) v1(43.43,10.18) v1(43.56,48.66) v1(43.69,13.86) v1(44.2,11.2) v1(45.09,11.96) v1(46.1,12.85) v1(46.74,19.2) v1(46.86,45.61) v1(47.12,41.68) v1(47.24,43.96) v1(47.69,19.2) v1(47.69,18.34) v1(48.51,19.2) v1(50.42,19.45) v1(50.42,18.44) v1(50.8,15.77) v1(51.05,17.55) v1(51.18,16.53) v1(51.31,19.45) v1(51.31,18.49) v1(54.36,38.63) v1(54.48,37.74) v1(54.74,36.98) v1(54.86,35.58) v1(55.25,37.74) v1(55.88,36.98)
VCC: length 140.4
  Top Layer w2: H2.1 57.28,21.1 59.18,23.01 C1.1 59.16,24.42 59.16,36.6 SW1.2
  Bottom Layer w0.7: 18.23,21.67 H1.1 ; R20.1 29.84,27.37 29.76,27.45
  Bottom Layer w1: C10.2 62.42,29.61 60.96,29.61 C9.1 63.25,35.71 63.25,43.2 60.61,45.83 U2.1
  Bottom Layer w2: H2.1 40.77,21.32 D7.2 34.63,27.45 25.18,27.45 D6.2 18.83,21.1 H1.1
ADC1: length 11.1
  Bottom Layer w0.3: R6.2 22.05,47.14 R10.1 24.49,44.7 U1.16
ADC2: length 13.9
  Bottom Layer w0.3: R7.2 20.79,50.48 R11.1 24.99,46.28 U1.17
ADC3: length 22.3
  Bottom Layer w0.3: U1.18 25.49,53.78 22.86,56.41 21.46,56.41 18.88,53.83 R8.2
ADC4: length 24.1
  Bottom Layer w0.3: U1.19 25.99,55.36 R13.1 22.69,58.31 20.83,58.31 19.69,57.17 R9.2
LED: length 6
  Bottom Layer w0.3: LED2.1 23.01,42.41 23.99,41.44 U1.15
PUMP: length 18.7
  Bottom Layer w0.3: U1.43 25.49,30.33 21.46,26.31 18.39,26.31 U3.1 15.49,23.42 15.49,22.88 13.98,21.36 R17.1
RX: length 20.8
  Bottom Layer w0.3: H6.2 8.76,32.79 9.65,32.79 16.26,39.39 22.73,39.39 22.99,39.64 U1.13
SDA: length 20.2
  Bottom Layer w0.3: U1.46 23.99,30.89 21.18,28.09 9.65,28.09 H4.2
SDL: length 18.4
  Bottom Layer w0.3: U1.45 24.49,30.35 21.21,27.07 14.73,27.07 13.08,25.42 H4.1
SERVO: length 31.3
  Bottom Layer w0.3: 49.28,16.66 49.28,20.72 40.1,29.89 27.91,29.89 27.49,30.32 U1.39
SET: length 38.9
  Top Layer w0.3: v1(23.11,36.34) 30.99,36.34 33.88,39.24 33.88,51.77 33.81,51.7 C7.2 29.59,52.94 29.59,55.77 30.24,56.42 34.41,56.42
  Bottom Layer w0.3: U1.7 23.07,36.29 v1(23.11,36.34)
SV: length 27.7
  Bottom Layer w0.3: U1.42 25.99,29.78 26.29,29.48 38.99,29.48 43.37,25.11 U4.1 43.37,19.02 R19.1
SWCLK: length 29.8
  Top Layer w0.3: H5.3 31.62,27.96 v1(29.08,30.5)
  Bottom Layer w0.3: U1.37 28.49,31.1 v1(29.08,30.5)
SWDIO: length 33.4
  Top Layer w0.3: v1(31.75,31.26) 34.16,28.85 H5.2
  Bottom Layer w0.3: U1.34 31.26,34.29 31.75,33.8 v1(31.75,31.26)
TRIODE: length 54.4
  Bottom Layer w0.7: 29.84,14.36 R21.2 ; 29.84,14.36 20.33,14.36 15.49,19.21 R17.2 15.66,19.88 U3.2 ; 29.84,14.36 R20.2 ; 29.84,14.36 33.16,14.36 34.29,13.23 34.29,9.55 36.07,7.77 38.86,7.77 46.86,15.77 46.86,17.03 R19.2 45.28,19.02 U4.2
TX: length 16.1
  Bottom Layer w0.3: U1.12 16.68,38.79 9.14,31.26 H6.3
$1N1024: length 5
  Bottom Layer w0.3: X1.3 18.22,32.91 19.3,32.91 20.19,33.8 20.19,34.9 20.59,35.29 U1.5
$1N1025: length 3.5
  Bottom Layer w0.3: X1.1 18.7,35.79 U1.6
$1N1270: length 2.1
  Bottom Layer w1: R2.2 LED1.2
$1N1274: length 2.1
  Bottom Layer w0.3: LED2.2 R3.2
$1N1385: length 33
  Top Layer w2: DC1.1 10.21,40.19 28.3,58.27 SW1.3
$1N2282: length 17.7
  Bottom Layer w1: L1.1 58.38,44.13 U2.2 50.25,44.13 48.51,45.87 48.51,47.1 D1.2
$1N13168: length 21.4
  Bottom Layer w0.3: U3.3 13.55,22.59 12.7,21.74 12.7,19.2 13.49,18.41 14.12,18.41 R15.1 19.04,13.48 25.62,13.48 Q1.1
$1N15259: length 13.3
  Bottom Layer w2: D6.1 27.52,21.42 Q1.4 24.67,18.56 H1.2
$1N15509: length 13.1
  Bottom Layer w0.3: U4.3 44.32,16.9 R18.1 39.24,11.82 37.07,11.82
$1N15513: length 13
  Bottom Layer w2: D7.1 32.29,21.38 Q2.4 35.11,18.56 H2.2

## Copper pours and planes (outline as drawn; the poured copper is in the pictures)
GND on Top Layer: -0.51,66.7 67.18,66.7 67.18,-2.27 -0.51,-2.27
GND on Bottom Layer: -0.25,66.31 66.68,66.31 66.68,-0.74 -0.25,-0.74

Small or netless copper shapes (teardrops, artwork), in the pictures only: 14 on Top Layer, 78 on Bottom Layer

## Text on the board
Bottom Silkscreen Layer: TX RX | SDL SDA | 3.3 DIO CLK GND | + - | - + | GND 5V IN
Top Silkscreen Layer: GND CLK DIO 3.3V | ON       OFF | V2.1 | SRH
